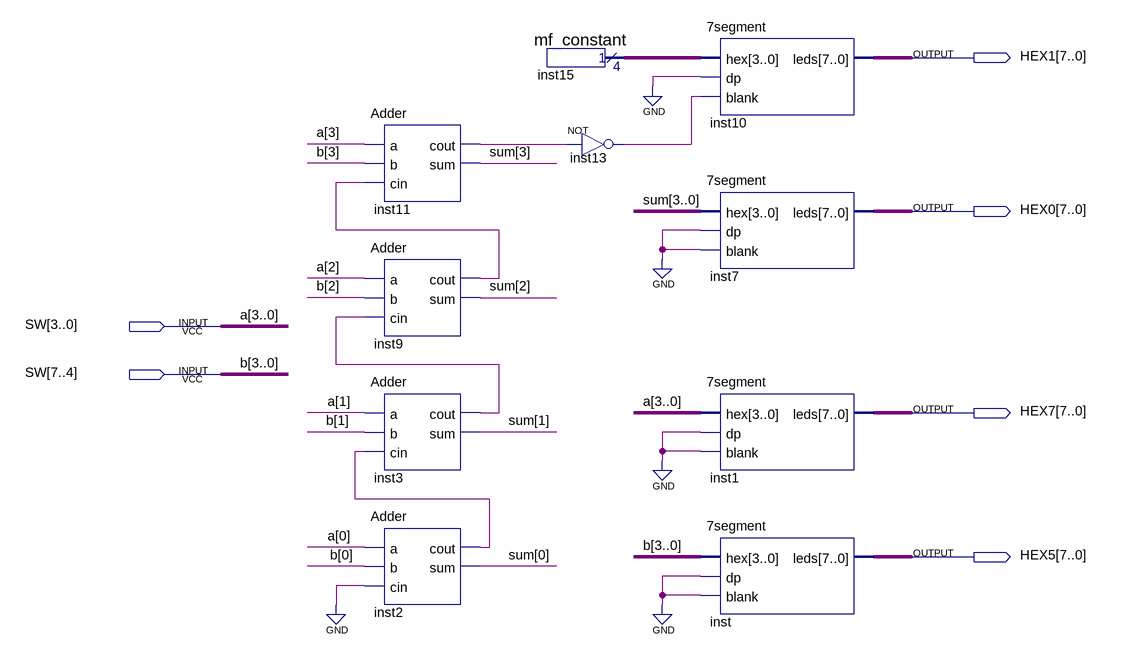
[diagram p0: schematic sheet]
// Quartus schematic LEDtest.bdf as structural Verilog: 10 symbols, 6 pins
module LEDtest (
  input  [7:0] SW,
  output [7:0] HEX1,
  output [7:0] HEX0,
  output [7:0] HEX7,
  output [7:0] HEX5
);

  wire inst2_cout, inst3_cout, inst9_cout, inst11_cout, inst13_out;
  wire [3:0] inst15_result, sum;

  Adder inst11 (.a(SW[3]), .b(SW[7]), .cin(inst9_cout), .cout(inst11_cout), .sum(sum[3]));
  Adder inst9 (.a(SW[2]), .b(SW[6]), .cin(inst3_cout), .cout(inst9_cout), .sum(sum[2]));
  Adder inst3 (.a(SW[1]), .b(SW[5]), .cin(inst2_cout), .cout(inst3_cout), .sum(sum[1]));
  Adder inst2 (.a(SW[0]), .b(SW[4]), .cin(1'b0), .cout(inst2_cout), .sum(sum[0]));
  mf_constant inst15 (.result(inst15_result));
  not inst13 (inst13_out, inst11_cout);
  \7segment  inst10 (.hex(inst15_result), .dp(1'b0), .blank(inst13_out), .leds(HEX1));
  \7segment  inst7 (.hex(sum), .dp(1'b0), .blank(1'b0), .leds(HEX0));
  \7segment  inst1 (.hex(SW[3:0]), .dp(1'b0), .blank(1'b0), .leds(HEX7));
  \7segment  inst (.hex(SW[7:4]), .dp(1'b0), .blank(1'b0), .leds(HEX5));

  // Other names for the same wires on the sheet: a[3:0] = SW[3:0]; b[3:0] = SW[7:4]
endmodule
